# Altium schematic sheet Block.SchDoc: Title
size A3; Date: Date; CompanyName: Integrated Micro-Electronics Bulgaria; Organization: Design & Development Department; Address1: Drawing Type; Address2: Address 1; Address3: Address 2; Address4: Address 3; DocumentNumber: 730xxx; Revision: 01; SheetNumber: 1; SheetTotal: 1; PageSetup: Record=PageOptions|CenterHorizontal=True|CenterVertical=True|PrintScale=0.70|XCorrection=1.00|YCorrection=1.00|PrintKind=2|BorderSize=5000000|LeftOffset=0|BottomOffset=0|Orientation=2|PaperLength=1000|PaperWidth=1000|Scale=100|PaperSource=7|PrintQuality=-4|MediaType=1|DitherType=10|PaperKind=A4|PrintScaleMode=1; SheetSize: A3; Time: Time; ModifiedDate: Mod. Date
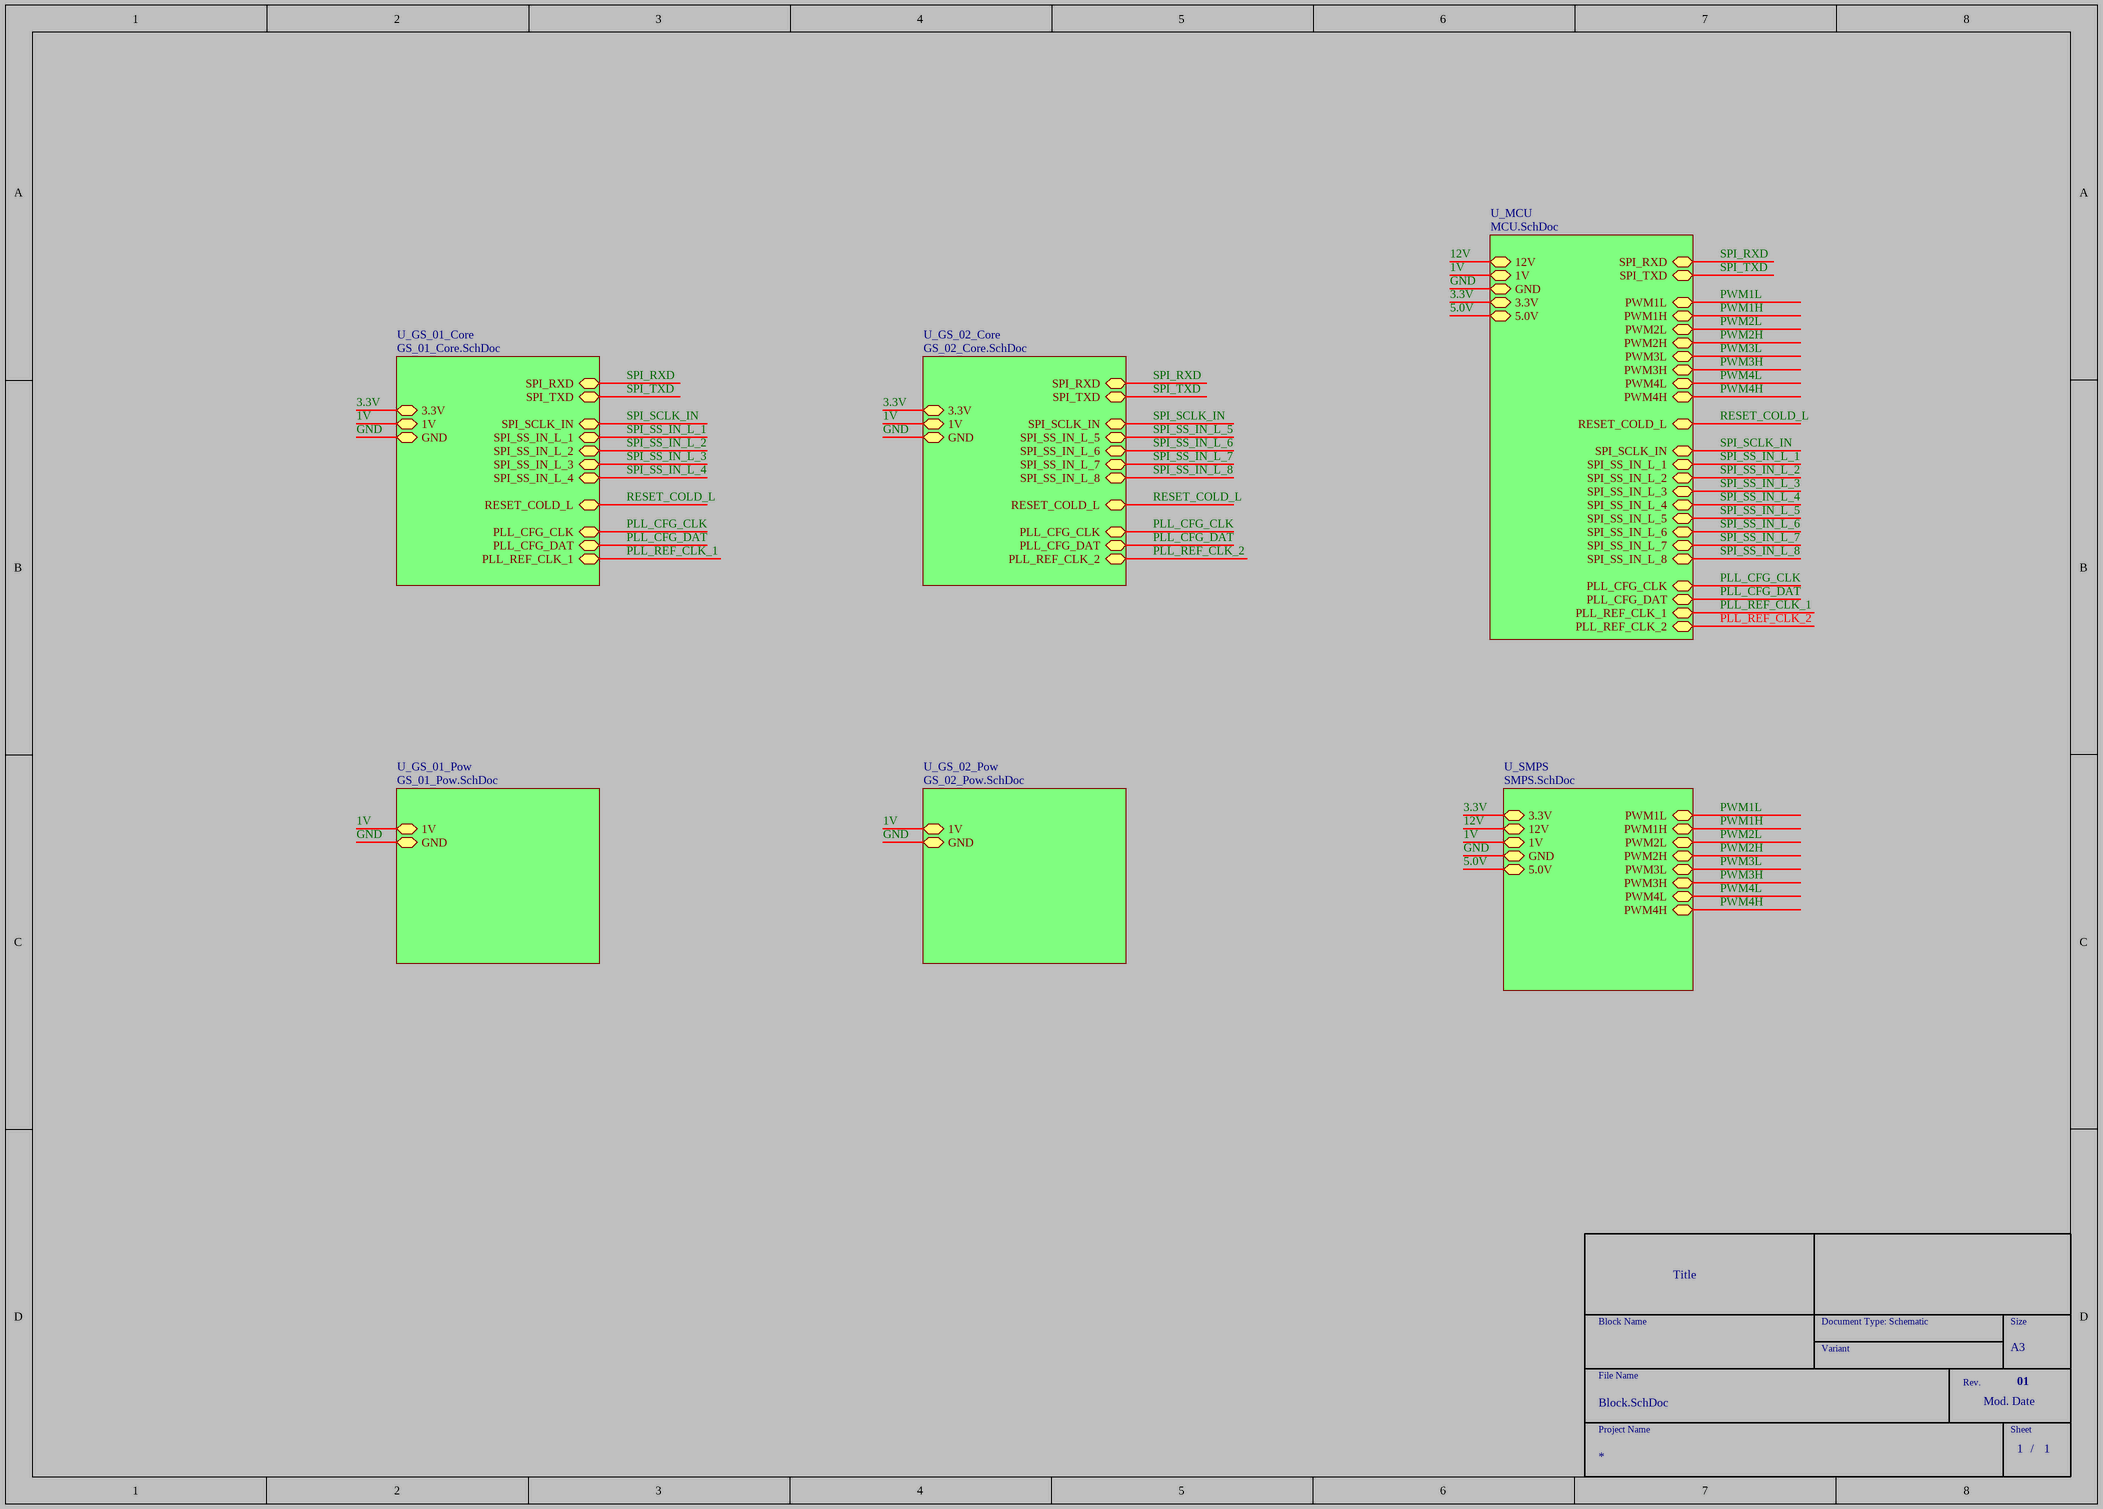
[diagram p0: Block.SchDoc]

## Sub-sheets
U_GS_01_Core = GS_01_Core.SchDoc: GND, 1V, 3.3V, SPI_RXD, SPI_TXD, SPI_SS_IN_L_4, SPI_SS_IN_L_3, SPI_SS_IN_L_2, SPI_SS_IN_L_1, RESET_COLD_L, SPI_SCLK_IN, PLL_CFG_CLK, PLL_CFG_DAT, PLL_REF_CLK_1
U_GS_01_Pow = GS_01_Pow.SchDoc: 1V, GND
U_GS_02_Core = GS_02_Core.SchDoc: GND, 1V, 3.3V, SPI_RXD, SPI_TXD, SPI_SS_IN_L_8, SPI_SS_IN_L_7, SPI_SS_IN_L_6, SPI_SS_IN_L_5, RESET_COLD_L, SPI_SCLK_IN, PLL_CFG_CLK, PLL_CFG_DAT, PLL_REF_CLK_2
U_GS_02_Pow = GS_02_Pow.SchDoc: 1V, GND
U_MCU = MCU.SchDoc: 1V, GND, 12V, 3.3V, 5.0V, SPI_RXD, SPI_TXD, PWM3H, PWM4L, PWM4H, PWM3L, PWM2H, PWM2L, PWM1H, PWM1L, SPI_SS_IN_L_8, SPI_SS_IN_L_7, SPI_SS_IN_L_6, SPI_SS_IN_L_5, SPI_SS_IN_L_4, SPI_SS_IN_L_3, SPI_SS_IN_L_2, SPI_SS_IN_L_1, RESET_COLD_L, SPI_SCLK_IN, PLL_CFG_CLK, PLL_CFG_DAT, PLL_REF_CLK_1, PLL_REF_CLK_2
U_SMPS = SMPS.SchDoc: 1V, GND, 12V, 3.3V, 5.0V, PWM3H, PWM4L, PWM4H, PWM3L, PWM2H, PWM2L, PWM1H, PWM1L

## Nets
1V: sheet U_GS_01_Pow/1V, sheet U_GS_02_Core/1V, sheet U_GS_02_Pow/1V, sheet U_MCU/1V, sheet U_SMPS/1V, sheet U_GS_01_Core/1V
3.3V: sheet U_GS_02_Core/3.3V, sheet U_MCU/3.3V, sheet U_SMPS/3.3V, sheet U_GS_01_Core/3.3V
5.0V: sheet U_MCU/5.0V, sheet U_SMPS/5.0V
12V: sheet U_MCU/12V, sheet U_SMPS/12V
GND: sheet U_GS_01_Pow/GND, sheet U_GS_02_Core/GND, sheet U_GS_02_Pow/GND, sheet U_MCU/GND, sheet U_SMPS/GND, sheet U_GS_01_Core/GND
PLL_CFG_CLK: sheet U_GS_02_Core/PLL_CFG_CLK, sheet U_MCU/PLL_CFG_CLK, sheet U_GS_01_Core/PLL_CFG_CLK
PLL_CFG_DAT: sheet U_GS_02_Core/PLL_CFG_DAT, sheet U_MCU/PLL_CFG_DAT, sheet U_GS_01_Core/PLL_CFG_DAT
PLL_REF_CLK_1: sheet U_MCU/PLL_REF_CLK_1, sheet U_GS_01_Core/PLL_REF_CLK_1
PLL_REF_CLK_2: sheet U_GS_02_Core/PLL_REF_CLK_2, sheet U_MCU/PLL_REF_CLK_2
PWM1H: sheet U_MCU/PWM1H, sheet U_SMPS/PWM1H
PWM1L: sheet U_MCU/PWM1L, sheet U_SMPS/PWM1L
PWM2H: sheet U_MCU/PWM2H, sheet U_SMPS/PWM2H
PWM2L: sheet U_MCU/PWM2L, sheet U_SMPS/PWM2L
PWM3H: sheet U_MCU/PWM3H, sheet U_SMPS/PWM3H
PWM3L: sheet U_MCU/PWM3L, sheet U_SMPS/PWM3L
PWM4H: sheet U_MCU/PWM4H, sheet U_SMPS/PWM4H
PWM4L: sheet U_MCU/PWM4L, sheet U_SMPS/PWM4L
RESET_COLD_L: sheet U_GS_02_Core/RESET_COLD_L, sheet U_MCU/RESET_COLD_L, sheet U_GS_01_Core/RESET_COLD_L
SPI_RXD: sheet U_GS_02_Core/SPI_RXD, sheet U_MCU/SPI_RXD, sheet U_GS_01_Core/SPI_RXD
SPI_SCLK_IN: sheet U_GS_02_Core/SPI_SCLK_IN, sheet U_MCU/SPI_SCLK_IN, sheet U_GS_01_Core/SPI_SCLK_IN
SPI_SS_IN_L_1: sheet U_MCU/SPI_SS_IN_L_1, sheet U_GS_01_Core/SPI_SS_IN_L_1
SPI_SS_IN_L_2: sheet U_MCU/SPI_SS_IN_L_2, sheet U_GS_01_Core/SPI_SS_IN_L_2
SPI_SS_IN_L_3: sheet U_MCU/SPI_SS_IN_L_3, sheet U_GS_01_Core/SPI_SS_IN_L_3
SPI_SS_IN_L_4: sheet U_MCU/SPI_SS_IN_L_4, sheet U_GS_01_Core/SPI_SS_IN_L_4
SPI_SS_IN_L_5: sheet U_GS_02_Core/SPI_SS_IN_L_5, sheet U_MCU/SPI_SS_IN_L_5
SPI_SS_IN_L_6: sheet U_GS_02_Core/SPI_SS_IN_L_6, sheet U_MCU/SPI_SS_IN_L_6
SPI_SS_IN_L_7: sheet U_GS_02_Core/SPI_SS_IN_L_7, sheet U_MCU/SPI_SS_IN_L_7
SPI_SS_IN_L_8: sheet U_GS_02_Core/SPI_SS_IN_L_8, sheet U_MCU/SPI_SS_IN_L_8
SPI_TXD: sheet U_GS_02_Core/SPI_TXD, sheet U_MCU/SPI_TXD, sheet U_GS_01_Core/SPI_TXD

## Notes on the sheet
- Block Name
- Document Type: Schematic
- Size
- File Name
- Variant
- Rev.
- Project Name
- Sheet
- /